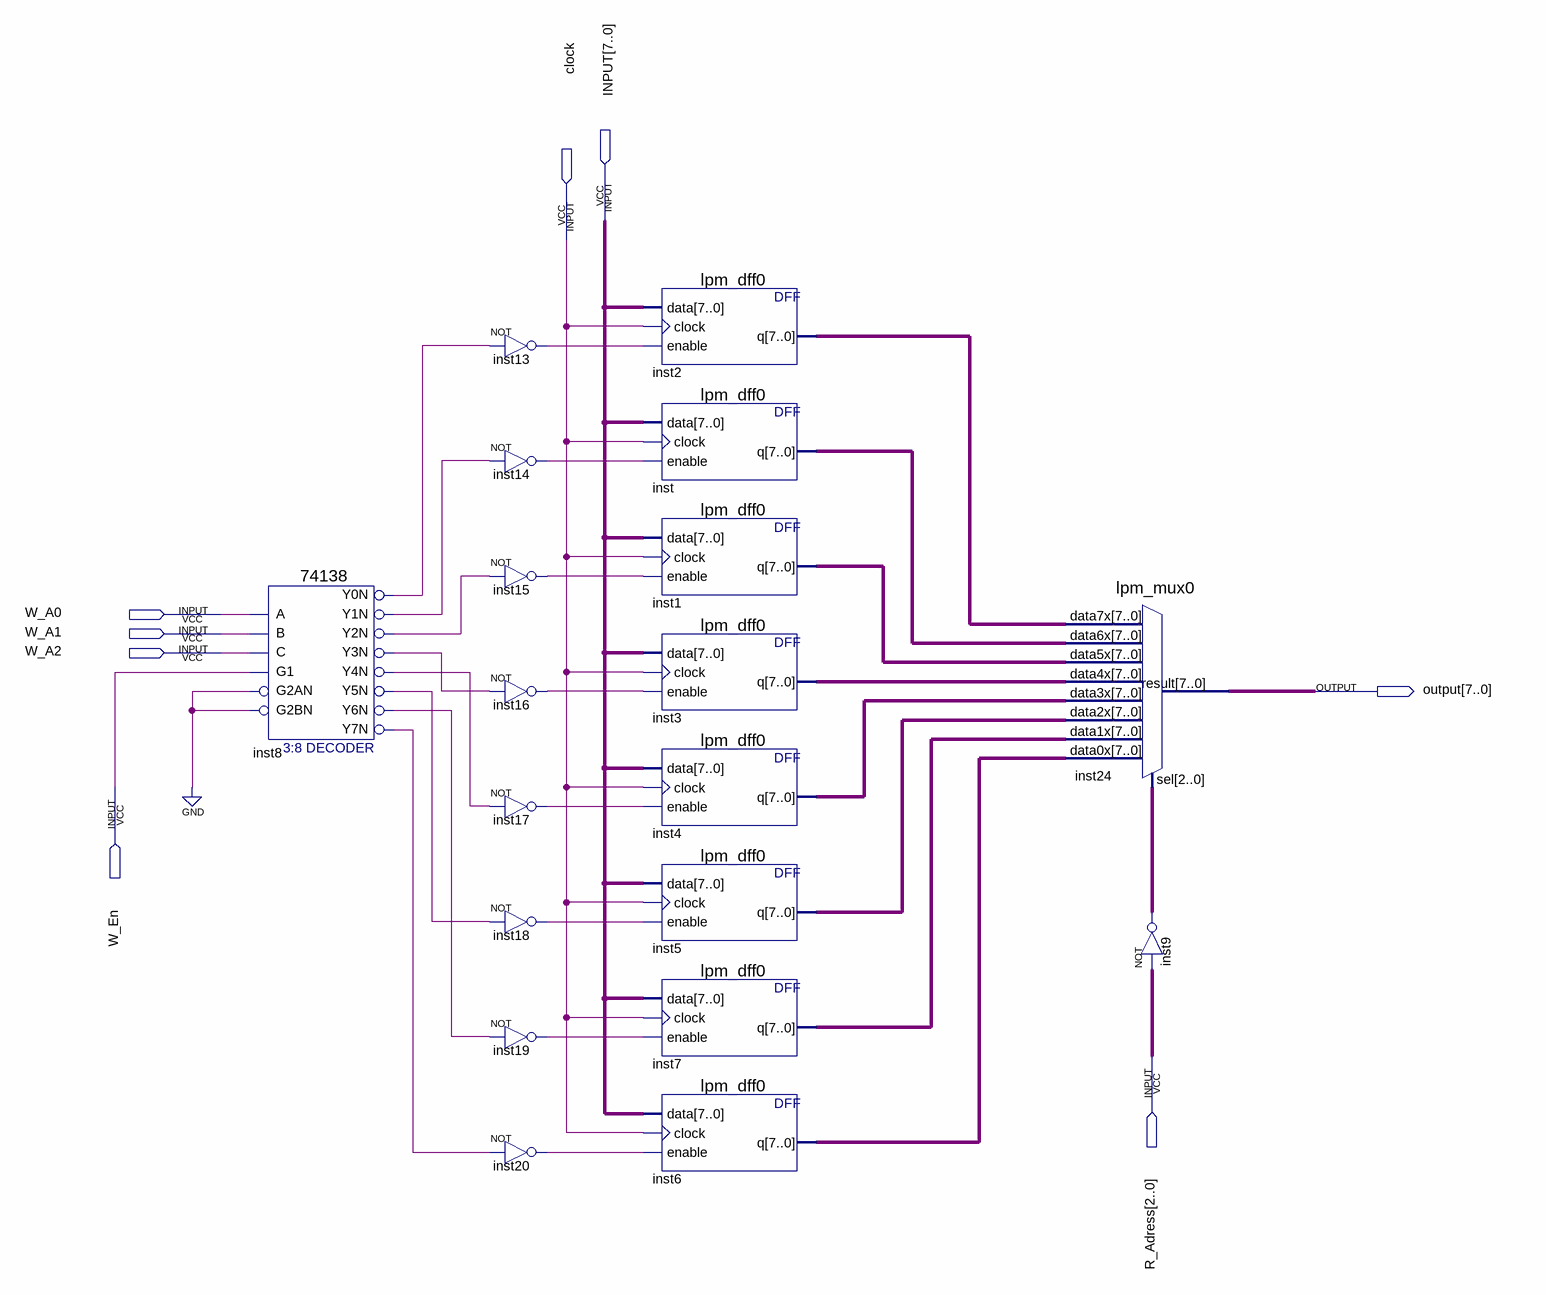
[diagram p0: schematic sheet]
// Quartus schematic cos_lab1.bdf as structural Verilog: 19 symbols, 8 pins
module cos_lab1 (
  input  [7:0] INPUT,
  input  clock,
  input  W_A0,
  input  W_A1,
  input  W_A2,
  input  W_En,
  input  [2:0] R_Adress,
  output [7:0] \output 
);

  wire inst8_y0n, inst8_y1n, inst8_y2n, inst8_y3n, inst8_y4n, inst8_y5n, inst8_y6n, inst8_y7n, inst13_out,
       inst14_out, inst15_out, inst16_out, inst17_out, inst18_out, inst19_out, inst20_out;
  wire [2:0] inst9_out;
  wire [7:0] inst1_q, inst2_q, inst3_q, inst4_q, inst5_q, inst6_q, inst7_q, inst_q;

  \74138  inst8 (
    .A(W_A0), .B(W_A1), .G1(W_En), .C(W_A2), .G2AN(1'b0), .G2BN(1'b0), .Y0N(inst8_y0n), .Y1N(inst8_y1n),
    .Y2N(inst8_y2n), .Y3N(inst8_y3n), .Y4N(inst8_y4n), .Y5N(inst8_y5n), .Y6N(inst8_y6n), .Y7N(inst8_y7n));
  not inst13 (inst13_out, inst8_y0n);
  not inst14 (inst14_out, inst8_y1n);
  not inst15 (inst15_out, inst8_y2n);
  not inst16 (inst16_out, inst8_y3n);
  not inst17 (inst17_out, inst8_y4n);
  not inst18 (inst18_out, inst8_y5n);
  not inst19 (inst19_out, inst8_y6n);
  not inst20 (inst20_out, inst8_y7n);
  lpm_dff0 inst2 (.data(INPUT), .clock(clock), .enable(inst13_out), .q(inst2_q));
  lpm_dff0 inst (.data(INPUT), .clock(clock), .enable(inst14_out), .q(inst_q));
  lpm_dff0 inst1 (.data(INPUT), .clock(clock), .enable(inst15_out), .q(inst1_q));
  lpm_dff0 inst3 (.data(INPUT), .clock(clock), .enable(inst16_out), .q(inst3_q));
  lpm_dff0 inst4 (.data(INPUT), .clock(clock), .enable(inst17_out), .q(inst4_q));
  lpm_dff0 inst5 (.data(INPUT), .clock(clock), .enable(inst18_out), .q(inst5_q));
  lpm_dff0 inst7 (.data(INPUT), .clock(clock), .enable(inst19_out), .q(inst7_q));
  lpm_dff0 inst6 (.data(INPUT), .clock(clock), .enable(inst20_out), .q(inst6_q));
  lpm_mux0 inst24 (
    .data7x(inst2_q), .data6x(inst_q), .data5x(inst1_q), .data4x(inst3_q), .data3x(inst4_q),
    .data2x(inst5_q), .data1x(inst7_q), .data0x(inst6_q), .sel(inst9_out), .result(\output ));
  assign inst9_out = ~R_Adress;  // NOT inst9, 3 bits wide
endmodule
